# EAGLE design DIN4-break (EAGLE 6.6.0)
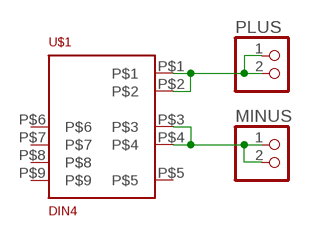
[diagram p0: schematic, sheet 1]

## Parts
MINUS  PINHD-1X2  [1X02]
PLUS  PINHD-1X2  [1X02]
U$1  DIN4  [DIN4]

## Nets
MINUS: MINUS.1 MINUS.2 U$1.P$3 U$1.P$4
PLUS: PLUS.1 PLUS.2 U$1.P$1 U$1.P$2
Unconnected: U$1.P$5 U$1.P$6 U$1.P$7 U$1.P$8 U$1.P$9

## Library data of the parts
MINUS PLUS = pinhead:PINHD-1X2: PIN HEADER
U$1 = PCR-Connector:DIN4

## Board
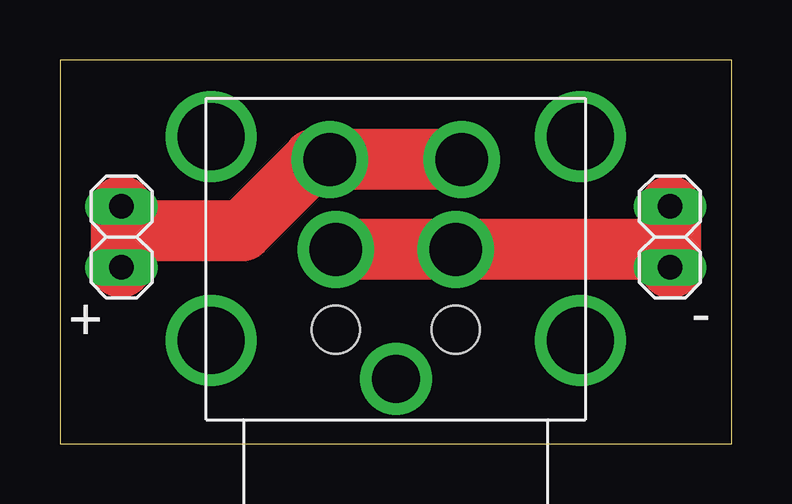
[diagram p1: board, top side]
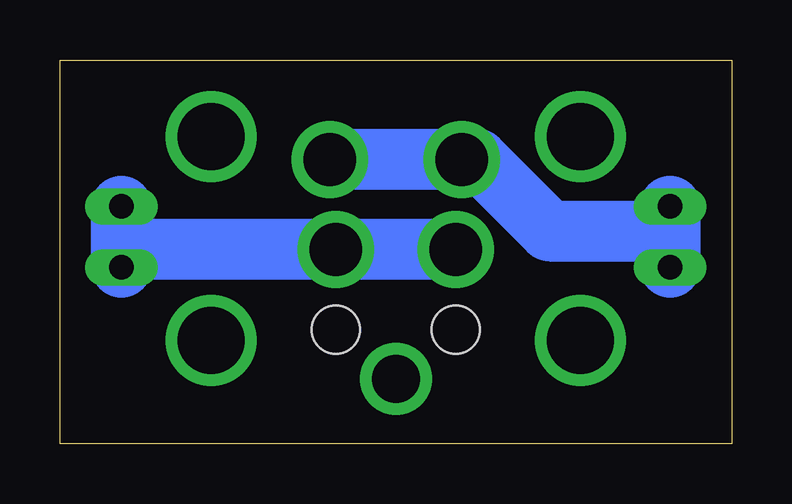
[diagram p2: board, bottom side, seen from below]

Size 28 x 16 mm. Coordinates in mm from the lower left corner, seen from the top.
Outline: 0,0 28,0 28,16 0,16 0,0
Copper layers (1*16): Top 0.035mm / dielectric 1.53mm / Bottom 0.035mm
Design rules "pban_5mil-l2": minimum track width 5mil, minimum drill 0.3mm, track to track 5mil, track to pad 0.229mm, pad to pad 5mil, via to via 5mil, smd to smd 5mil, copper to edge 0.5mm, drill to drill 0.5mm, minimum pad ring 0.15mm, minimum via ring 0.15mm, stop-mask expansion 4mil, vias tented up to drill 0.35mm, thermal gap 10mil

### Footprints (pad centres in the part's own frame; a part is rotated, then mirrored left to right if it is on the bottom)
1X02 = drill 1.016 long: 1 -1.27,0; 2 1.27,0
DIN4 = drill 2.2: P$1 -2.75,10.85; P$2 2.75,10.85; P$3 -2.5,7.1; P$4 2.5,7.1 | drill 2: P$5 0,1.7 | drill 2.8: P$6 -7.7,11.8; P$7 -7.7,3.3; P$8 7.7,3.3; P$9 7.7,11.8 | hole 2: -2.5,3.75; 2.5,3.75

### Placement (x,y rotation side)
MINUS  25.43,8.62 90 top
PLUS  2.57,8.62 90 top
U$1  14,1 0 top

### Tracks (layer width: path | path; a pad name or v marks a point on that pad's centre or on a via)
MINUS
  Top 2.54: 11.38,8.06 11.44,8.11 25.43,8.11 MINUS.2 25.45,9.87 25.45,7.33
  Bottom 2.54: MINUS.1 25.43,8.1 | MINUS.2 25.43,9.08 25.43,8.1 | U$1.P$4 U$1.P$3 25.43,8.1
PLUS
  Top 2.54: 16.77,11.79 16.72,11.85 10.57,11.85 7.6,8.87 2.57,8.87 PLUS.2 2.54,9.87 2.54,7.35
  Bottom 2.54: U$1.P$2 U$1.P$1 10.57,11.85 7.6,8.87 2.57,8.87 | PLUS.2 2.57,8.87 | 2.57,8.87 PLUS.1

### Text on the board
tPlace: - | +